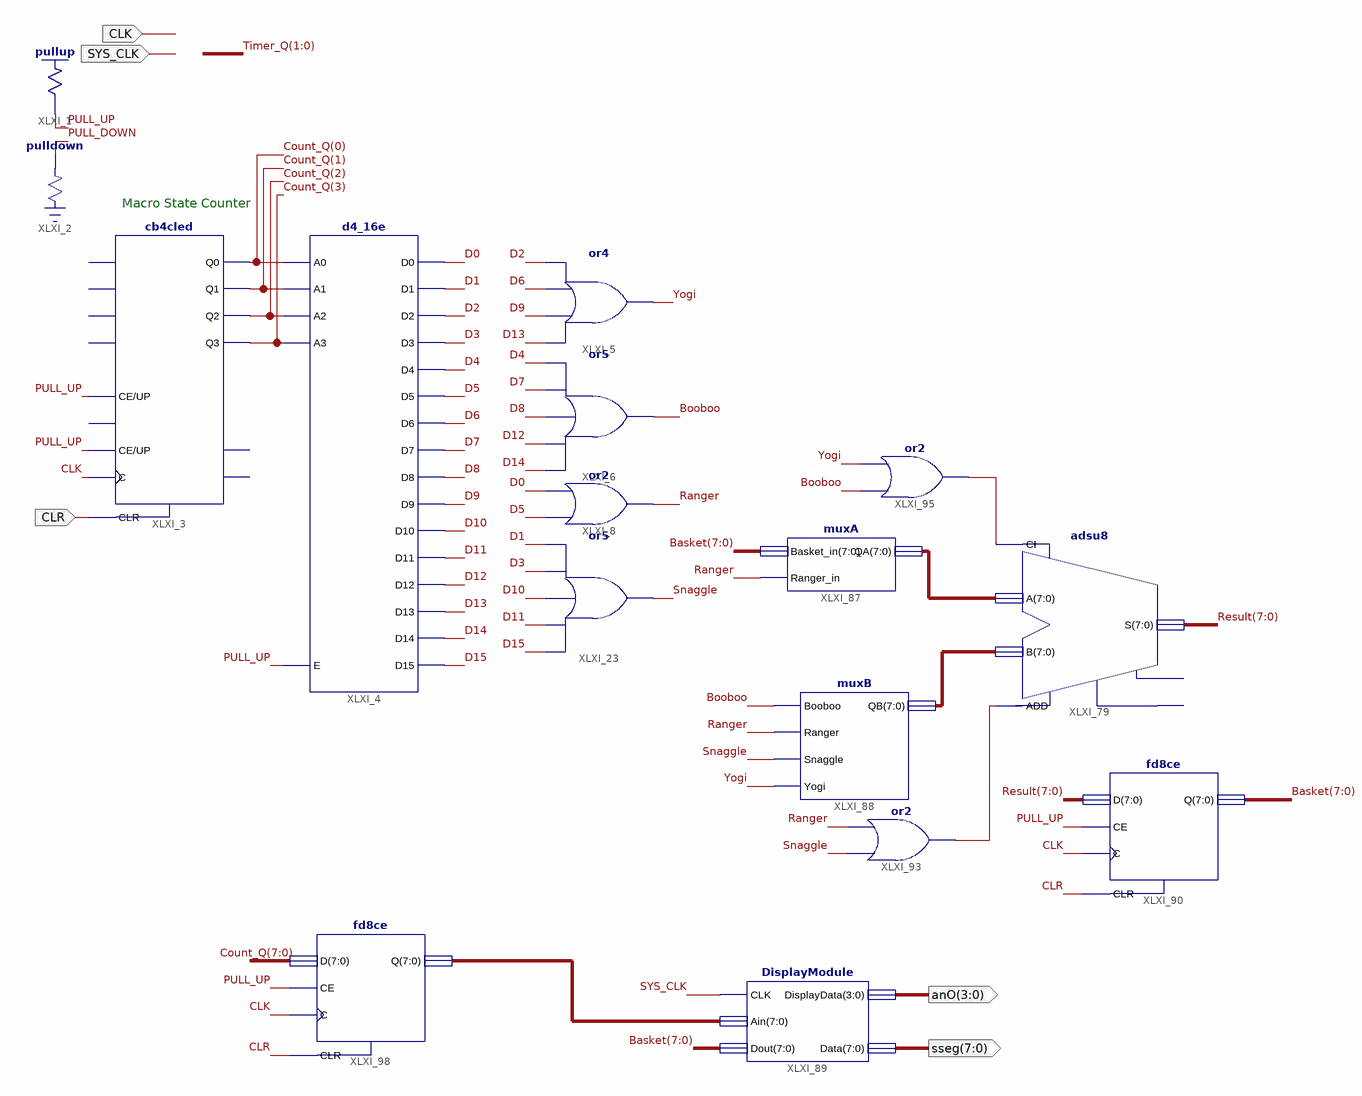
[diagram p0: schematic sheet 1]
// Xilinx ISE schematic Exp5.sch (spartan3e) as structural Verilog: 16 symbols, 5 ports
module Exp5 (
  input  CLK,
  input  SYS_CLK,
  input  CLR,
  output [7:0] sseg,
  output [3:0] anO
);

  wire Booboo, D0, D1, D2, D3, D4, D5, D6, D7, D8, D9, D10, D11, D12, D13, D14, D15, PULL_DOWN, PULL_UP, R,
       Ranger, Snaggle, XLXN_147, Yogi;
  wire [7:0] Basket, Count_Q, Result, XLXN_98, XLXN_99, XLXN_162;

  \pullup  XLXI_1 (.O(PULL_UP));
  \pulldown  XLXI_2 (.O(PULL_DOWN));
  d4_16e XLXI_4 (
    .A0(Count_Q[0]), .A1(Count_Q[1]), .A2(Count_Q[2]), .A3(Count_Q[3]), .E(PULL_UP), .D0(D0), .D1(D1),
    .D10(D10), .D11(D11), .D12(D12), .D13(D13), .D14(D14), .D15(D15), .D2(D2), .D3(D3), .D4(D4), .D5(D5),
    .D6(D6), .D7(D7), .D8(D8), .D9(D9));
  or XLXI_5 (Yogi, D13, D9, D6, D2);
  or XLXI_6 (Booboo, D14, D12, D8, D7, D4);
  or XLXI_8 (Ranger, D5, D0);
  or XLXI_23 (Snaggle, D15, D11, D10, D3, D1);
  cb4cled XLXI_3 (
    .C(CLK), .CE(PULL_UP), .CLR(CLR), .UP(PULL_UP), .Q0(Count_Q[0]), .Q1(Count_Q[1]), .Q2(Count_Q[2]),
    .Q3(Count_Q[3]));  // open: D0, D1, D2, D3, L, CEO, TC
  adsu8 XLXI_79 (.A(XLXN_98), .ADD(R), .B(XLXN_99), .CI(XLXN_147), .S(Result));  // open: CO, OFL
  muxA XLXI_87 (.Basket_in(Basket), .Ranger_in(Ranger), .QA(XLXN_98));
  muxB XLXI_88 (.Booboo(Booboo), .Ranger(Ranger), .Snaggle(Snaggle), .Yogi(Yogi), .QB(XLXN_99));
  DisplayModule XLXI_89 (.CLK(SYS_CLK), .Ain(XLXN_162), .Dout(Basket), .DisplayData(anO), .Data(sseg));
  fd8ce XLXI_90 (.C(CLK), .CE(PULL_UP), .CLR(CLR), .D(Result), .Q(Basket));
  or XLXI_93 (R, Snaggle, Ranger);
  or XLXI_95 (XLXN_147, Booboo, Yogi);
  fd8ce XLXI_98 (.C(CLK), .CE(PULL_UP), .CLR(CLR), .D(Count_Q), .Q(XLXN_162));

  // Notes on the sheet:
  //   Macro State Counter
endmodule
